# Altium schematic sheet Sheet1.SchDoc
size A4; SheetNumber: 1; SheetTotal: 1
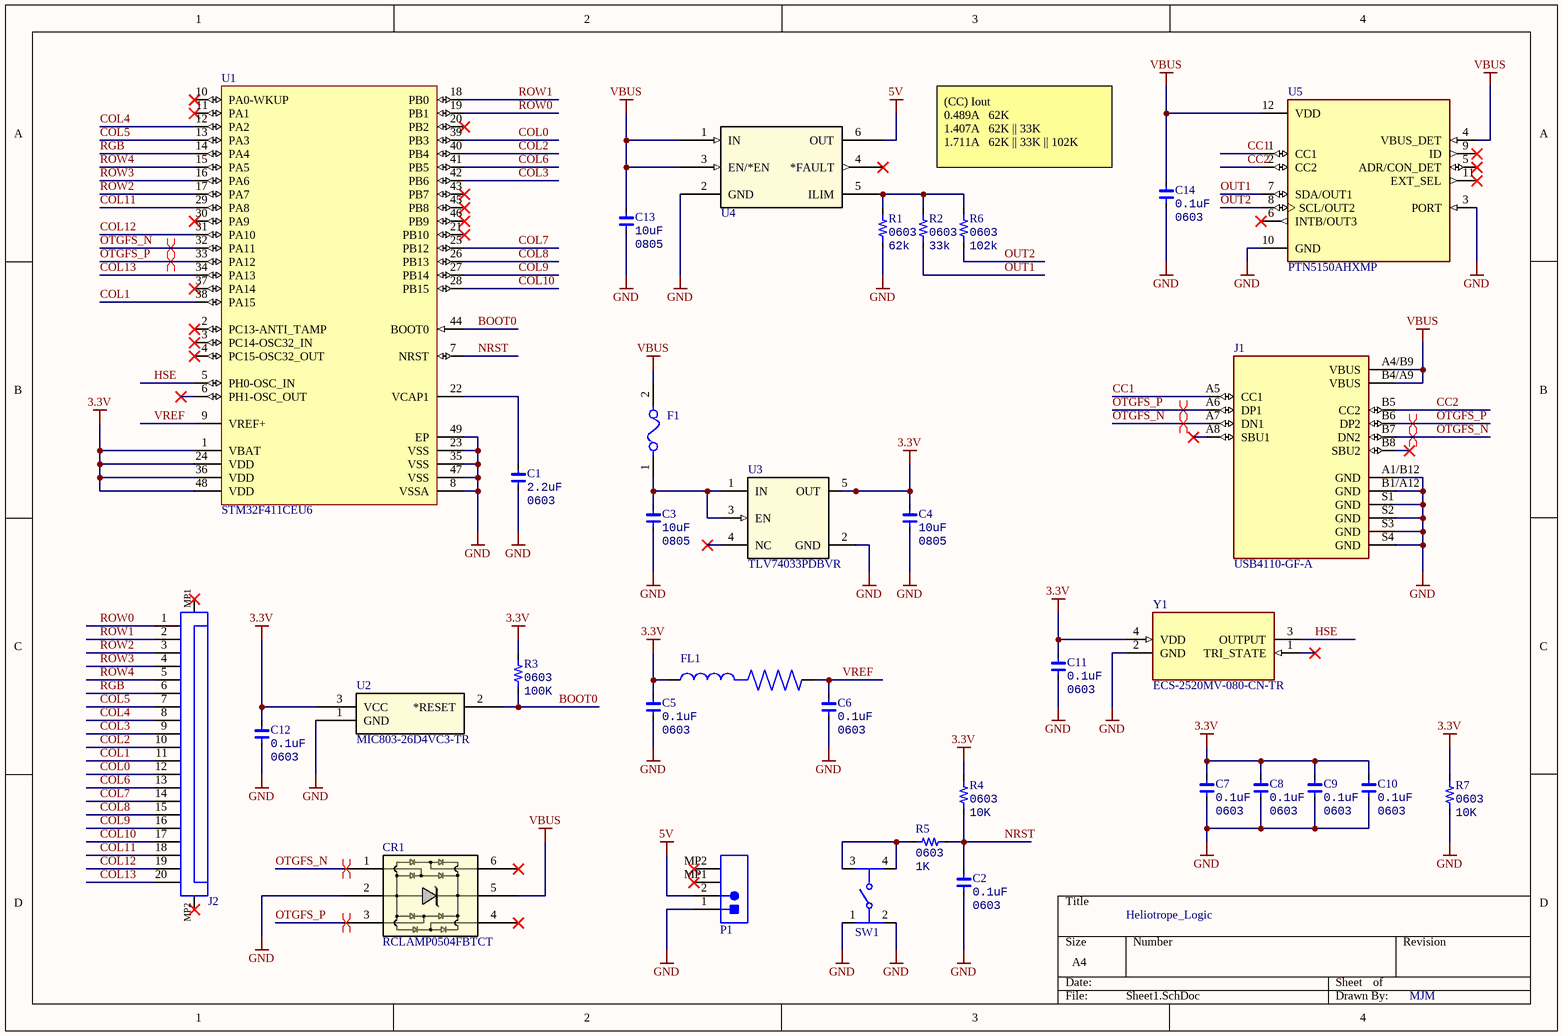
[diagram p0: Sheet1.SchDoc]

## Parts
C1  value 2.2uF  Type: 0603  [FP-CC0603-DA-MFG]  (hidden comment: CC0603KRX7R6BB225)
C2  value 0.1uF  Type: 0603  [FP-CC0603-DA-MFG]  (hidden comment: CC0603JRX7R9BB104)
C3  value 10uF  Type: 0805  [FP-GRM21B-0_15-MFG]  (hidden comment: GRM21BR71A106KA73K)
C4  value 10uF  Type: 0805  [FP-GRM21B-0_15-MFG]  (hidden comment: GRM21BR71A106KA73K)
C5  value 0.1uF  Type: 0603  [FP-CC0603-DA-MFG]  (hidden comment: CC0603JRX7R9BB104)
C6  value 0.1uF  Type: 0603  [FP-CC0603-DA-MFG]  (hidden comment: CC0603JRX7R9BB104)
C7  value 0.1uF  Type: 0603  [FP-CC0603-DA-MFG]  (hidden comment: CC0603JRX7R9BB104)
C8  value 0.1uF  Type: 0603  [FP-CC0603-DA-MFG]  (hidden comment: CC0603JRX7R9BB104)
C9  value 0.1uF  Type: 0603  [FP-CC0603-DA-MFG]  (hidden comment: CC0603JRX7R9BB104)
C10  value 0.1uF  Type: 0603  [FP-CC0603-DA-MFG]  (hidden comment: CC0603JRX7R9BB104)
C11  value 0.1uF  Type: 0603  [FP-CC0603-DA-MFG]  (hidden comment: CC0603JRX7R9BB104)
C12  value 0.1uF  Type: 0603  [FP-CC0603-DA-MFG]  (hidden comment: CC0603JRX7R9BB104)
C13  value 10uF  Type: 0805  [FP-GRM21B-0_15-MFG]  (hidden comment: GRM21BR71A106KA73K)
C14  value 0.1uF  Type: 0603  [FP-CC0603-DA-MFG]  (hidden comment: CC0603JRX7R9BB104)
CR1  RCLAMP0504FBTCT  [SC70_RCLAMP_SEM]
F1  0603L010YR  [FP-0603L-MFG]  (value not drawn)
FL1  BLM18AG601SN1D  [BEADC1608X95N]  (value not drawn)
J1  USB4110-GF-A  [GCT_USB4110-GF-A_REVB]
J2  68712014522  [68712014522]  (value not drawn)
P1  53261-0271  [MOLX-53261-0271_V]  (value not drawn)
R1  value 62k  Type: 0603  [FP-RMCF0603-MFG]  (hidden comment: RMCF0603FT62K0)
R2  value 33k  Type: 0603  [FP-RMCF0603-MFG]  (hidden comment: RMCF0603FT33K0)
R3  value 100K  Type: 0603  [FP-RMCF0603-MFG]  (hidden comment: RMCF0603JT100K)
R4  value 10K  Type: 0603  [FP-RMCF0603-MFG]  (hidden comment: RMCF0603JT10K0)
R5  value 1K  Type: 0603  [FP-RMCF0603-MFG]  (hidden comment: RMCF0603JT1K00)
R6  value 102k  Type: 0603  [FP-RMCF0603-MFG]  (hidden comment: RMCF0603FT102K)
R7  value 10K  Type: 0603  [FP-RMCF0603-MFG]  (hidden comment: RMCF0603JT10K0)
SW1  PTS526SK15SMTR2LFS  [FP-PTS526SK15SMTR2LFS-MFG]  (value not drawn)
U1  STM32F411CEU6  [STM-UFQFPN48_M]
U2  MIC803-26D4VC3-TR  [SC-70_C3_MCH]
U3  TLV74033PDBVR  [DBV0005A-IPC_A]
U4  AP22653AW6-7  [SOT26-A1_DIO]  (value not drawn)
U5  PTN5150AHXMP  [IC_PTN5150AHXMP]
Y1  ECS-2520MV-080-CN-TR  [OSC_ECS-2520S25-250-FN-TR]

## Nets
3.3V: C4.2 C5.2 C7.2 C8.2 C9.2 C10.2 C11.2 C12.2 FL1.1 R3.2 R4.2 R7.2 U1.1(VBAT) U1.24(VDD) U1.36(VDD) U1.48(VDD) U2.3(VCC) U3.5(OUT) Y1.4(VDD)
5V: P1.2 U4.6(OUT)
GND: C1.1 C2.1 C3.1 C4.1 C5.1 C6.1 C7.1 C8.1 C9.1 C10.1 C11.1 C12.1 C13.1 C14.1 CR1.2 J1.A1/B12(GND) J1.B1/A12(GND) J1.S1(GND) J1.S2(GND) J1.S3(GND) J1.S4(GND) P1.1 R1.1 R7.1 SW1.1 SW1.2 U1.8(VSSA) U1.23(VSS) U1.35(VSS) U1.47(VSS) U1.49(EP) U2.1(GND) U3.2(GND) U4.2(GND) U5.3(PORT) U5.10(GND) Y1.2(GND)
VBUS: C13.2 C14.2 CR1.5 F1.2 J1.A4/B9(VBUS) J1.B4/A9(VBUS) U4.1(IN) U4.3(EN/*EN) U5.4(VBUS_DET) U5.12(VDD)
BOOT0: R3.1 U1.44(BOOT0) U2.2(*RESET)
CC1: J1.A5(CC1) U5.1(CC1)
CC2: J1.B5(CC2) U5.2(CC2)
COL0: J2.12 U1.39(PB3)
COL1: J2.11 U1.38(PA15)
COL2: J2.10 U1.40(PB4)
COL3: J2.9 U1.42(PB6)
COL4: J2.8 U1.12(PA2)
COL5: J2.7 U1.13(PA3)
COL6: J2.13 U1.41(PB5)
COL7: J2.14 U1.25(PB12)
COL8: J2.15 U1.26(PB13)
COL9: J2.16 U1.27(PB14)
COL10: J2.17 U1.28(PB15)
COL11: J2.18 U1.29(PA8)
COL12: J2.19 U1.31(PA10)
COL13: J2.20 U1.34(PA13)
HSE: U1.5(PH0-OSC_IN) Y1.3(OUTPUT)
NRST: C2.2 R4.1 R5.1 U1.7(NRST)
OTGFS_N: CR1.1 J1.A7(DN1) J1.B7(DN2) U1.32(PA11)
OTGFS_P: CR1.3 J1.A6(DP1) J1.B6(DP2) U1.33(PA12)
OUT1: R2.1 U5.7(SDA/OUT1)
OUT2: R6.1 U5.8(SCL/OUT2)
RGB: J2.6 U1.14(PA4)
ROW0: J2.1 U1.19(PB1)
ROW1: J2.2 U1.18(PB0)
ROW2: J2.3 U1.17(PA7)
ROW3: J2.4 U1.16(PA6)
ROW4: J2.5 U1.15(PA5)
VREF: C6.2 FL1.2 U1.9(VREF+)
NetC1_2: C1.2 U1.22(VCAP1)
NetC3_2: C3.2 F1.1 U3.1(IN) U3.3(EN)
NetR1_2: R1.2 R2.2 R6.2 U4.5(ILIM)
NetR5_2: R5.2 SW1.3 SW1.4

Not connected (* = marked no-connect by the designer): CR1 4* 6*; J1 A8(SBU1)* B8(SBU2)*; J2 MP1* MP2*; P1 MP1* MP2*; U1 2(PC13-ANTI_TAMP)* 3(PC14-OSC32_IN)* 4(PC15-OSC32_OUT)* 6(PH1-OSC_OUT)* 10(PA0-WKUP)* 11(PA1)* 20(PB2)* 21(PB10)* 30(PA9)* 37(PA14)* 43(PB7)* 45(PB8)* 46(PB9)*; U3 4(NC)*; U4 4(*FAULT)*; U5 5(ADR/CON_DET)* 6(INTB/OUT3)* 9(ID)* 11(EXT_SEL)*; Y1 1(TRI_STATE)*

## Layout directives
differential pair: OTGFS_N, OTGFS_P

## Notes on the sheet
- (CC) Iout
  0.489A   62K
  1.407A   62K || 33K
  1.711A   62K || 33K || 102K
- Heliotrope_Logic
- MJM

## Library data of the parts
C1 = CMP-004-000012-5: Cap Ceramic 2.2uF 10V X7R 10% SMD 0603 125C Paper T/R
C2 C5-C12 C14 = CMP-004-000009-6: 0603 0.1 uF 50 V ±5 % Tolerance X7R SMT Multilayer Ceramic Capacitor
C3 C4 C13 = CMP-004-000013-3: Cap Ceramic 10uF 10V X7R 10% Pad SMD 0805 125C T/R
CR1 = CMP-138-000000-2: ESD Suppressor TVS Quad Uni-Dir 30kV 6-Pin SC-70 T/R; Mfr_Name: Semtech; Type: DEV; Copyright: Copyright (C) 2022 Ultra Librarian. All rights reserved.; Pin Count: 6; Component Type: Standard; RefDes: RefDes; Digi-Key_Part_Number_1: RCLAMP0504FBTCTTR-ND; Design Item ID: RCLAMP0504FBTCT; Source: RCLAMP0504FBTCT.SchLib; Manufacturer_Part_Number: RCLAMP0504FBTCT; Digi-Key_Part_Number_3: RCLAMP0504FBTCTDKR-ND; Digi-Key_Part_Number_2: RCLAMP0504FBTCTCT-ND
F1 = CMP-096-000003-1: 15VDC 100mA
FL1 = CMP-032-000000-2: 600 Ohms @ 100MHz 1 Ferrite Bead 0603 _1608 Metric_ 500mA 380mOhm; Manufacturer: Murata; value: 600 Ohm; Design Item ID: BLM18AG601SN1D; Digi-Key_Part_Number: 490-1014-1-ND; Component Type: Standard; Package: 0608; Manufacturer Product Number: BLM18AG601SN1D; Pin Count: 2; Source: SnapEDAsch.SchLib
J1 = CMP-130-000000-9: Conn USB Type C RCP 16 POS 0.3mm/0.5mm Solder ST SMD 16 Terminal 1 Port T/R; Availability: Unavailable; Design Item ID: USB4110-GF-A; Price: None; Pin Count: 16; Source: USB4110-GF-A_REVB.SchLib; Component Type: Standard; MP: USB4110-GF-A; Package: None; Value: *
J2 = CMP-00003-2: Ffc / Fpc Board Connector, Zif, Surface Mount, Plug, 20, Bottom, 0.5 Mm Rohs Compliant: Yes; MF: Wurth Electronics; SnapEDA_Link: https://www.snapeda.com/parts/68712014522/Wurth+Electronics+Inc./view-part/?ref=snap; Design Item ID: 68712014522; Purchase-URL: https://pricing.snapeda.com/search/part/68712014522/?ref=eda; Pin Count: 20; Package: None; Value: *; Availability: In Stock; MP: 68712014522; Component Type: Standard; Price: None; Source: 68712014522.SchLib; Check_prices: https://www.snapeda.com/parts/68712014522/Wurth+Electronics+Inc./view-part/?ref=eda
P1 = CMP-042-000002-1: 1.25mm Pitch PicoBlade™ Header, Surface Mount, Right Angle, Lead-Free, 2 Circuits
R1 = CMP-012-000002-2: Res Thick Film 0603 62K Ohm 1% 1/10W ±100ppm/°C Molded SMD SMD Paper T/R
R2 = CMP-012-000005-1: Res Thick Film 0603 33K Ohm 1% 0.1W(1/10W) ±100ppm/C Pad SMD Automotive T/R
R3 = CMP-000004-8: Res Thick Film 0603 100K Ohm 5% 1/10W ±200ppm/°C Molded SMD Paper T/R
R4 R7 = CMP-012-000009-4: Res Thick Film 0603 10K Ohm 5% 1/10W ±100ppm/°C Molded SMD SMD Paper T/R
R5 = CMP-000007-3: Res Thick Film 0603 1K Ohm 5% 1/10W ±200ppm/°C Molded SMD Paper T/R
R6 = CMP-012-000004-1: Res Thick Film 0603 102K Ohm 1% 1/10W ±100ppm/°C Molded SMD SMD Paper T/R
SW1 = CMP-014-000000-1: Switch Tactile N.O. SPST Round Button Gull Wing 0.05A 12VDC 200000Cycles 2.55N SMD T/R
U1 = CMP-000017-1: ARM® Cortex®-M4 STM32 F4 Microcontroller IC 32-Bit 100MHz 512KB (512K x 8) FLASH 48-UFQFPN (7x7)
U2 = CMP-136-000000-2: 3-Pin Microprocessor Supervisor Circuit w/ Open-Drain Reset Output; Mfr_Name: Microchip; Digi-Key_Part_Number_2: 576-3799-1-ND; Type: Simple Reset/Power-On Reset; Digi-Key_Part_Number_4: 576-3799-6-ND; Pin Count: 3; Component Type: Standard; Source: MIC803-26D4VC3-TR.SchLib; Copyright: Copyright (C) 2022 Ultra Librarian. All rights reserved.; Digi-Key_Part_Number_1: 1611-MIC803-26D4VC3-CT-ND; Design Item ID: MIC803-26D4VC3-TR; Digi-Key_Part_Number_3: 576-3799-2-ND; RefDes: RefDes; Manufacturer_Part_Number: MIC803-26D4VC3-TR
U3 = CMP-140-000000-6: 300-mA low-dropout (LDO) regulator with foldback current limit 5-SOT-23 -40 to 125; Mfr_Name: Texas Instruments; Component Type: Standard; RefDes: RefDes; Digi-Key_Part_Number_1: 296-TLV74033PDBVRTR-ND; Source: TLV74033PDBVR.SchLib; Design Item ID: TLV74033PDBVR; Copyright: Copyright (C) 2022 Ultra Librarian. All rights reserved.; Digi-Key_Part_Number_3: 296-TLV74033PDBVRDKR-ND; Digi-Key_Part_Number_2: 296-TLV74033PDBVRCT-ND; Type: DEV; Pin Count: 5; Manufacturer_Part_Number: TLV74033PDBVR
U4 = CMP-148-000002-2: PRECISION ADJUSTABLE CURRENT-LIMITED POWER SWITCHES, -40 to 85°C pF, RoHS; Mfr_Name: Diodes Inc; Component Type: Standard; Copyright: Copyright (C) 2022 Ultra Librarian. All rights reserved.; Source: AP22652AW6-7.SchLib; Manufacturer_Part_Number: AP22653AW6-7; Design Item ID: AP22653AW6-7; Pin Count: 6; Type: DEV; RefDes: RefDes
U5 = CMP-150-000000-2: PTN5150A Series 2.7 to 5.5 V CC Logic for USB Type-C Applications - XFQFN-12; MF: NXP USA; Design Item ID: PTN5150AHXMP; Value: *; Digi-Key_Part_Number: 568-13083-2-ND; Component Type: Standard; Purchase-URL: https://pricing.snapeda.com/search/part/PTN5150AHXMP/?ref=eda; Pin Count: 12; Package: XFQFN-12 NXP Semiconductors; SnapEDA_Link: https://www.snapeda.com/parts/PTN5150AHXMP/NXP+USA+Inc./view-part/?ref=snap; Check_prices: https://www.snapeda.com/parts/PTN5150AHXMP/NXP+USA+Inc./view-part/?ref=eda; MP: PTN5150AHXMP; Source: PTN5150AHXMP.SchLib
Y1 = CMP-142-000000-4: ECS-2520MV Series 8MHz 2.5x2mm 3.6 V SMT HCMOS Multivolt Crystal Oscillator; MF: ECS Inc.; Pin Count: 4; Design Item ID: ECS-2520MV-080-CN-TR; Digi-Key_Part_Number: XC3029CT-ND; MP: ECS-2520MV-080-CN-TR; Package: SMD-4 ECS International; Value: *; Source: ECS-2520MV-080-CN-TR.SchLib; Component Type: Standard